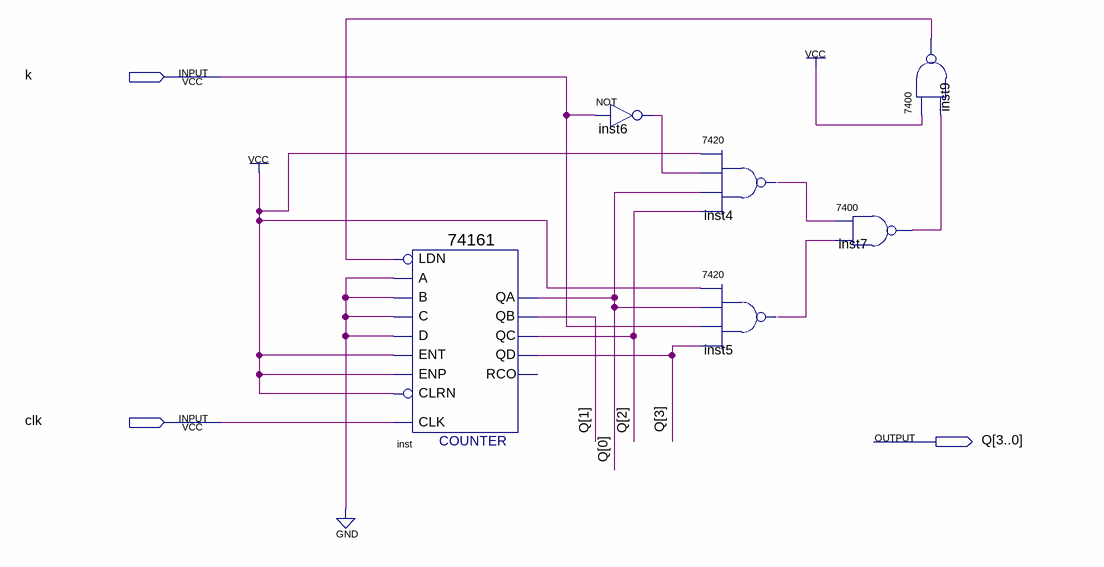
[diagram p0: schematic sheet]
// Quartus schematic M6_M10.bdf as structural Verilog: 6 symbols, 3 pins
module M6_M10 (
  input  k,
  input  clk,
  output [3:0] Q
);

  wire inst4_1, inst5_1, inst6_out, inst7_1, inst9_1;

  \74161  inst (
    .CLRN(1'b1), .CLK(clk), .ENP(1'b1), .LDN(inst9_1), .A(1'b0), .D(1'b0), .ENT(1'b1), .B(1'b0), .C(1'b0),
    .QD(Q[3]), .QC(Q[2]), .QB(Q[1]), .QA(Q[0]));  // open: RCO
  not inst6 (inst6_out, k);
  \7420  inst4 (.\4 (Q[0]), .\2 (1'b1), .\3 (inst6_out), .\5 (Q[2]), .\1 (inst4_1));
  \7420  inst5 (.\4 (k), .\2 (1'b1), .\3 (Q[0]), .\5 (Q[3]), .\1 (inst5_1));
  \7400  inst7 (.\3 (inst5_1), .\2 (inst4_1), .\1 (inst7_1));
  \7400  inst9 (.\3 (inst7_1), .\2 (1'b1), .\1 (inst9_1));
endmodule
